# Altium project ECE453_Interface.PrjPCB
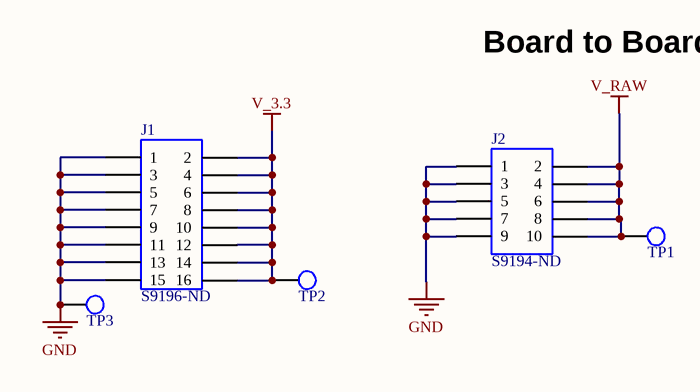
[diagram p0: 02 ECE453-Digital-Interface.SchDoc]
1 sheet, 5 parts. Net scope: global (net labels, ports and power ports of the same name join across sheets).
Board file: ECE453_Interface.PcbDoc

## Sheet 02 ECE453-Digital-Interface.SchDoc
size C; PageSetup: Record=PageOptions|CenterHorizontal=True|CenterVertical=True|PrintScale=0.70|XCorrection=1.00|YCorrection=1.00|PrintKind=1|BorderSize=5000000|LeftOffset=0|BottomOffset=0|Orientation=2|PaperLength=1000|PaperWidth=1000|Scale=100|PaperSource=7|PrintQuality=-3|MediaType=1|DitherType=10|PrintScaleMode=1|PaperKind=Tabloid|PaperIndex=3

### Parts
J1  Supplier Part Number 1: S9196-ND  [SFH11-PBPC-D08-ST-BK]  (hidden comment: SFH11-PBPC-D08-ST-BK)
J2  Supplier Part Number 1: S9194-ND  [SFH11-PBPC-D05-ST-BK]  (hidden comment: SFH11-PBPC-D05-ST-BK)
TP1  TP_1206  [TP-SMC-1206]  (value not drawn)
TP2  TP_1206  [TP-SMC-1206]  (value not drawn)
TP3  TP_1206  [TP-SMC-1206]  (value not drawn)

### Nets
GND: J1.1 J1.3 J1.5 J1.7 J1.9 J1.11 J1.13 J1.15 J2.1 J2.3 J2.5 J2.7 J2.9 TP3.1
V_3.3: J1.2 J1.4 J1.6 J1.8 J1.10 J1.12 J1.14 J1.16 TP2.1
V_RAW: J2.2 J2.4 J2.6 J2.8 J2.10 TP1.1

### Notes on the sheet
- Board to Board Connectors

### Library data of the parts
J1 = SFH11-PBPC-D08-ST-BK: CONN HDR 10POS 0.1 GOLD PCB; Manufacturer 1: Sullins; Number of Positions: 16; Connector Type: Header,Socket; Pitch: 0.1inch; ComponentLink1URL: https://datasheet.ciiva.com/754/sfh11-pxxc-dxx-st-xx11160-c-754555.pdf?src-supplier=Digi-Key; ComponentLink1Description: https://datasheet.ciiva.com/754/sfh11-pxxc-dxx-st-xx11160-c-754555.pdf?src-supplier=Digi-Key; Supplier 1: Digi-Key; Manufacturer Part Number 1: SFH11-PBPC-D08-ST-BK; Stock 1: 0; Pricing 1: 1=1.04000, 10=0.91600, 100=0.79000, 500=0.64638, 1000=0.57456, 5000=0.51870 (USD); RoHS: Yes; Mount: Through Hole; Color: Black; Contact Plating: Gold; Package Quantity: 1; Number of Rows: 2; Packaging: Tray; Termination: Solder; Row Spacing: 0.1inch; Lead Free: Lead Free; ComponentLink2URL: https://datasheet.ciiva.com/754/sfh11-pxxc-dxx-st-xx11160-c-754557.pdf?src-supplier=Digi-Key; ComponentLink2Description: https://datasheet.ciiva.com/754/sfh11-pxxc-dxx-st-xx11160-c-754557.pdf?src-supplier=Digi-Key
J2 = SFH11-PBPC-D05-ST-BK: CONN HDR 10POS 0.1 GOLD PCB; Manufacturer 1: Sullins; Number of Positions: 10; Connector Type: Header; Pitch: 0.1inch; Supplier 1: Digi-Key; Manufacturer Part Number 1: SFH11-PBPC-D05-ST-BK; Stock 1: 26289; Pricing 1: 1=0.66000, 10=0.57600, 100=0.49700, 500=0.40662, 1000=0.36144, 5000=0.32630 (USD); RoHS: Yes; Mount: Through Hole; Color: Black; Contact Plating: Gold; Package Quantity: 1; Number of Rows: 2; Packaging: Tray; Termination: Solder; Row Spacing: 0.1inch; Lead Free: Lead Free; ComponentLink1URL: https://datasheet.ciiva.com/754/sfh11-pxxc-dxx-st-xx11160-c-754555.pdf?src-supplier=Digi-Key; ComponentLink1Description: https://datasheet.ciiva.com/754/sfh11-pxxc-dxx-st-xx11160-c-754555.pdf?src-supplier=Digi-Key
TP1-TP3 = TP_1206: Test Point SMD 1206; Supplier 1: Digi-Key; Supplier Part Number 1: A106143CT-ND